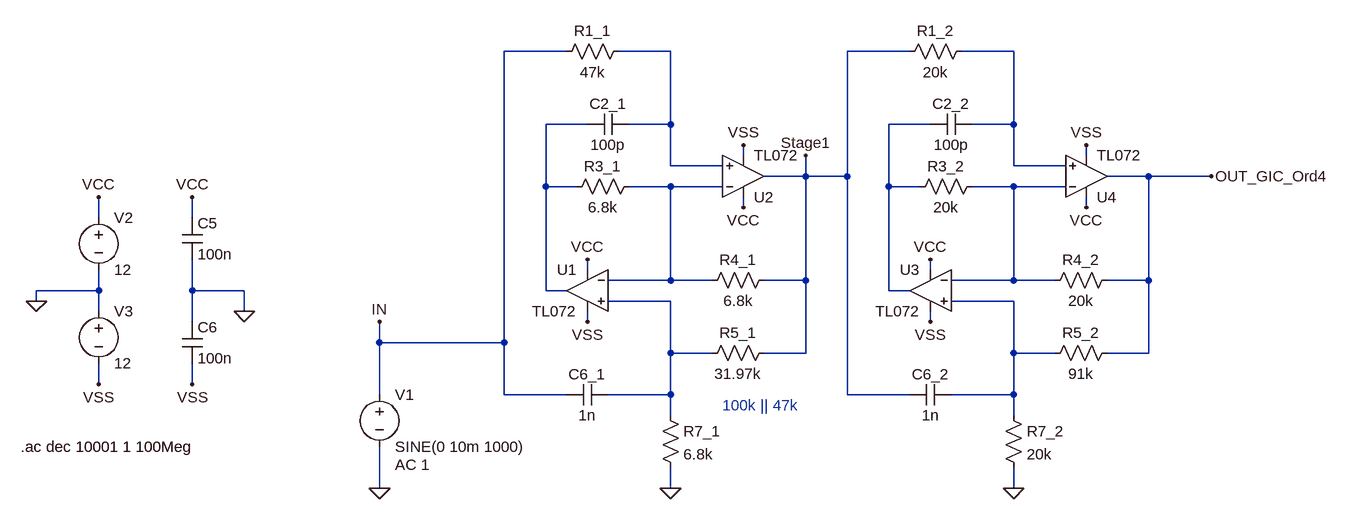
[diagram p0: schematic GIC_ordnung4_10kHz_1dB_30dB_inv_cheby.asc]
GIC_ordnung4_10kHz_1dB_30dB_inv_cheby.asc, the LTspice schematic file:
Version 4
SHEET 1 2500 736
WIRE 112 -64 16 -64
WIRE 272 -64 192 -64
WIRE 640 -64 544 -64
WIRE 800 -64 720 -64
WIRE 144 48 80 48
WIRE 272 48 272 -64
WIRE 272 48 208 48
WIRE 672 48 608 48
WIRE 800 48 800 -64
WIRE 800 48 736 48
WIRE 384 96 384 80
WIRE 912 96 912 80
WIRE 272 112 272 48
WIRE 352 112 272 112
WIRE 800 112 800 48
WIRE 880 112 800 112
WIRE 480 128 480 96
WIRE 480 128 416 128
WIRE 544 128 544 -64
WIRE 544 128 480 128
WIRE 1008 128 944 128
WIRE 1104 128 1008 128
WIRE 80 144 80 48
WIRE 128 144 80 144
WIRE 272 144 208 144
WIRE 352 144 272 144
WIRE 608 144 608 48
WIRE 656 144 608 144
WIRE 800 144 736 144
WIRE 880 144 800 144
WIRE 384 176 384 160
WIRE 912 176 912 160
WIRE -608 192 -608 160
WIRE -464 192 -464 160
WIRE 144 272 144 256
WIRE 672 272 672 256
WIRE 272 288 272 144
WIRE 272 288 176 288
WIRE 336 288 272 288
WIRE 480 288 480 128
WIRE 480 288 416 288
WIRE 800 288 800 144
WIRE 800 288 704 288
WIRE 864 288 800 288
WIRE 1008 288 1008 128
WIRE 1008 288 944 288
WIRE -608 304 -608 272
WIRE -608 304 -704 304
WIRE -464 304 -464 256
WIRE -384 304 -464 304
WIRE 80 304 80 144
WIRE 112 304 80 304
WIRE 608 304 608 144
WIRE 640 304 608 304
WIRE -704 320 -704 304
WIRE 272 320 176 320
WIRE 800 320 704 320
WIRE -608 336 -608 304
WIRE -384 336 -384 304
WIRE -464 352 -464 304
WIRE 144 352 144 336
WIRE 672 352 672 336
WIRE -176 384 -176 352
WIRE 16 384 16 -64
WIRE 16 384 -176 384
WIRE 272 400 272 320
WIRE 336 400 272 400
WIRE 480 400 480 288
WIRE 480 400 416 400
WIRE 800 400 800 320
WIRE 864 400 800 400
WIRE 1008 400 1008 288
WIRE 1008 400 944 400
WIRE -608 448 -608 416
WIRE -464 448 -464 416
WIRE -176 464 -176 384
WIRE 16 464 16 384
WIRE 112 464 16 464
WIRE 272 464 272 400
WIRE 272 464 176 464
WIRE 544 464 544 128
WIRE 640 464 544 464
WIRE 800 464 800 400
WIRE 800 464 704 464
WIRE 272 496 272 464
WIRE 800 496 800 464
WIRE -176 608 -176 544
WIRE 272 608 272 576
WIRE 800 608 800 576
FLAG -608 160 VCC
FLAG -608 448 VSS
FLAG -704 320 0
FLAG -464 160 VCC
FLAG -464 448 VSS
FLAG -384 336 0
FLAG -176 608 0
FLAG -176 352 IN
FLAG 144 256 VCC
FLAG 384 176 VCC
FLAG 144 352 VSS
FLAG 384 80 VSS
FLAG 272 608 0
FLAG 480 96 Stage1
FLAG 672 256 VCC
FLAG 912 176 VCC
FLAG 672 352 VSS
FLAG 912 80 VSS
FLAG 800 608 0
FLAG 1104 128 OUT_GIC_Ord4
SYMBOL voltage -176 448 R0
WINDOW 123 24 124 Left 2
WINDOW 39 0 0 Left 0
SYMATTR Value2 AC 1
SYMATTR InstName V1
SYMATTR Value SINE(0 10m 1000)
SYMBOL voltage -608 176 R0
WINDOW 123 0 0 Left 0
WINDOW 39 0 0 Left 0
SYMATTR InstName V2
SYMATTR Value 12
SYMBOL voltage -608 320 R0
WINDOW 123 0 0 Left 0
WINDOW 39 0 0 Left 0
SYMATTR InstName V3
SYMATTR Value 12
SYMBOL cap -480 192 R0
SYMATTR InstName C5
SYMATTR Value 100n
SYMBOL cap -480 352 R0
SYMATTR InstName C6
SYMATTR Value 100n
SYMBOL TL072 144 240 M0
SYMATTR InstName U1
SYMBOL TL072 384 192 M180
SYMATTR InstName U2
SYMBOL res 208 -80 R90
WINDOW 0 0 56 VBottom 2
WINDOW 3 32 56 VTop 2
SYMATTR InstName R1_1
SYMATTR Value 47k
SYMBOL res 224 128 R90
WINDOW 0 0 56 VBottom 2
WINDOW 3 32 56 VTop 2
SYMATTR InstName R3_1
SYMATTR Value 6.8k
SYMBOL res 432 272 R90
WINDOW 0 0 56 VBottom 2
WINDOW 3 32 56 VTop 2
SYMATTR InstName R4_1
SYMATTR Value 6.8k
SYMBOL res 432 384 R90
WINDOW 0 0 56 VBottom 2
WINDOW 3 32 56 VTop 2
SYMATTR InstName R5_1
SYMATTR Value 31.97k
SYMBOL res 256 480 R0
SYMATTR InstName R7_1
SYMATTR Value 6.8k
SYMBOL cap 208 32 R90
WINDOW 0 0 32 VBottom 2
WINDOW 3 32 32 VTop 2
SYMATTR InstName C2_1
SYMATTR Value 100p
SYMBOL cap 176 448 R90
WINDOW 0 0 32 VBottom 2
WINDOW 3 32 32 VTop 2
SYMATTR InstName C6_1
SYMATTR Value 1n
SYMBOL TL072 672 240 M0
SYMATTR InstName U3
SYMBOL TL072 912 192 M180
SYMATTR InstName U4
SYMBOL res 736 -80 R90
WINDOW 0 0 56 VBottom 2
WINDOW 3 32 56 VTop 2
SYMATTR InstName R1_2
SYMATTR Value 20k
SYMBOL res 752 128 R90
WINDOW 0 0 56 VBottom 2
WINDOW 3 32 56 VTop 2
SYMATTR InstName R3_2
SYMATTR Value 20k
SYMBOL res 960 272 R90
WINDOW 0 0 56 VBottom 2
WINDOW 3 32 56 VTop 2
SYMATTR InstName R4_2
SYMATTR Value 20k
SYMBOL res 960 384 R90
WINDOW 0 0 56 VBottom 2
WINDOW 3 32 56 VTop 2
SYMATTR InstName R5_2
SYMATTR Value 91k
SYMBOL res 784 480 R0
SYMATTR InstName R7_2
SYMATTR Value 20k
SYMBOL cap 736 32 R90
WINDOW 0 0 32 VBottom 2
WINDOW 3 32 32 VTop 2
SYMATTR InstName C2_2
SYMATTR Value 100p
SYMBOL cap 704 448 R90
WINDOW 0 0 32 VBottom 2
WINDOW 3 32 32 VTop 2
SYMATTR InstName C6_2
SYMATTR Value 1n
TEXT -728 544 Left 2 !.ac dec 10001 1 100Meg
TEXT 352 480 Left 2 ;100k || 47k

The netlist it stands for:
* GIC_ordnung4_10kHz_1dB_30dB_inv_cheby.asc
V1 IN 0 SINE(0 10m 1000) AC 1
V2 VCC 0 12
V3 0 VSS 12
C5 VCC 0 100n
C6 0 VSS 100n
* U1: TL072 (symbol TL072 not available, pins judged from their places): In+=N007 In-=N005 V+=VCC V-=VSS OUT=N003
* U2: TL072 (symbol TL072 not available, pins judged from their places): In+=N001 In-=N005 V+=VCC V-=VSS OUT=Stage1
R1_1 N001 IN 47k
R3_1 N005 N003 6.8k
R4_1 Stage1 N005 6.8k
R5_1 Stage1 N007 31.97k
R7_1 N007 0 6.8k
C2_1 N001 N003 100p
C6_1 N007 IN 1n
* U3: TL072 (symbol TL072 not available, pins judged from their places): In+=N008 In-=N006 V+=VCC V-=VSS OUT=N004
* U4: TL072 (symbol TL072 not available, pins judged from their places): In+=N002 In-=N006 V+=VCC V-=VSS OUT=OUT_GIC_Ord4
R1_2 N002 Stage1 20k
R3_2 N006 N004 20k
R4_2 OUT_GIC_Ord4 N006 20k
R5_2 OUT_GIC_Ord4 N008 91k
R7_2 N008 0 20k
C2_2 N002 N004 100p
C6_2 N008 Stage1 1n
.ac dec 10001 1 100Meg
* 100k || 47k
.backanno
.end